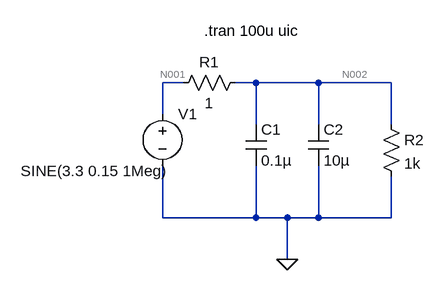
[diagram p0: schematic Efek kapasitor bypass pada jalur vdd pada accelerometer.asc]
Efek kapasitor bypass pada jalur vdd pada accelerometer.asc, the LTspice schematic file:
Version 4
SHEET 1 880 680
WIRE 64 80 32 80
WIRE 176 80 144 80
WIRE 272 80 176 80
WIRE 384 80 272 80
WIRE 32 128 32 80
WIRE 176 144 176 80
WIRE 272 144 272 80
WIRE 384 144 384 80
WIRE 32 288 32 208
WIRE 176 288 176 208
WIRE 176 288 32 288
WIRE 224 288 176 288
WIRE 272 288 272 208
WIRE 272 288 224 288
WIRE 384 288 384 224
WIRE 384 288 272 288
WIRE 224 352 224 288
FLAG 224 352 0
SYMBOL voltage 32 112 R0
WINDOW 3 -218 104 Left 2
WINDOW 123 0 0 Left 0
WINDOW 39 0 0 Left 0
SYMATTR InstName V1
SYMATTR Value SINE(3.3 0.15 1Meg)
SYMBOL res 160 64 R90
WINDOW 0 0 56 VBottom 2
WINDOW 3 32 56 VTop 2
SYMATTR InstName R1
SYMATTR Value 1
SYMBOL cap 160 144 R0
SYMATTR InstName C1
SYMATTR Value 0.1µ
SYMBOL cap 256 144 R0
SYMATTR InstName C2
SYMATTR Value 10µ
SYMBOL res 368 128 R0
SYMATTR InstName R2
SYMATTR Value 1k
TEXT 96 0 Left 2 !.tran 100u uic

The netlist it stands for:
* Efek kapasitor bypass pada jalur vdd pada accelerometer.asc
V1 N001 0 SINE(3.3 0.15 1Meg)
R1 N002 N001 1
C1 N002 0 0.1µ
C2 N002 0 10µ
R2 N002 0 1k
.tran 100u uic
.backanno
.end

* Results of the author's LTspice run, read from the files saved beside the schematic
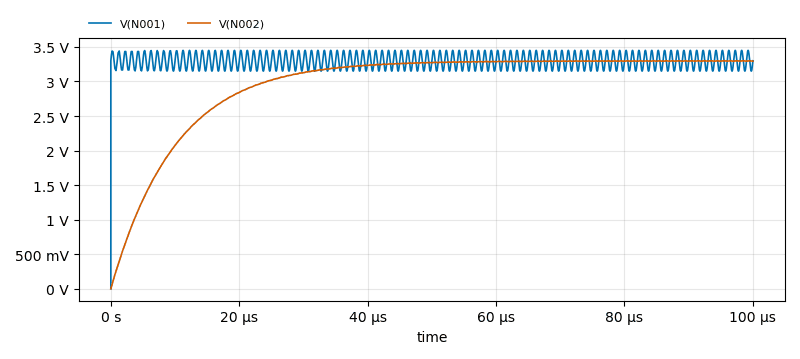
[diagram p1: Transient Analysis of Efek kapasitor bypass pada jalur vdd pada accelerometer.asc, plotted from the saved traces]
* Transient Analysis, 1 run:
*   V(N001): min 0 V, max 3.45 V, average 3.3 V, rms 3.302 V, last 3.3 V
*   V(N002): min 0 V, max 3.299 V, average 2.964 V, rms 3.037 V, last 3.294 V